# Altium schematic sheet QI9-2605-A01_.SchDoc
size D; SheetNumber: 1; SheetTotal: 1
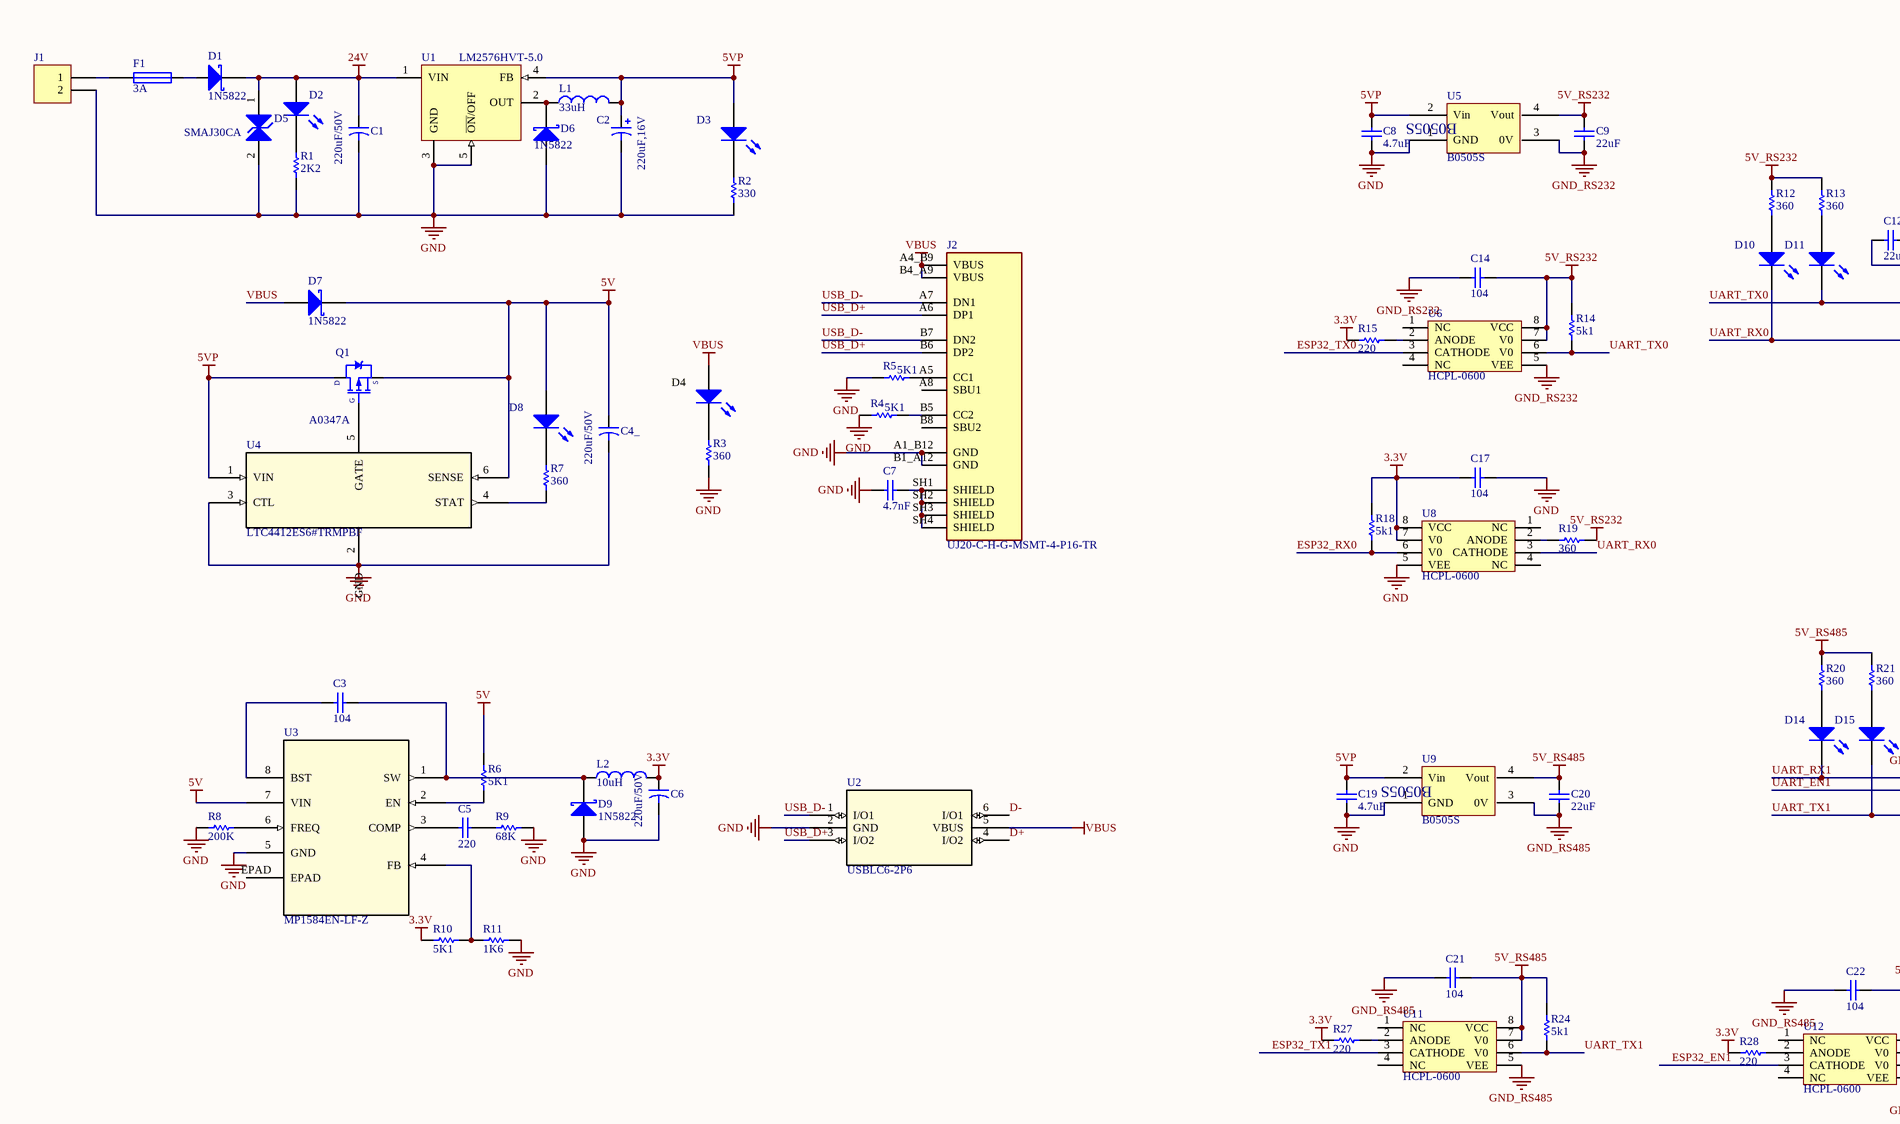
[diagram p0: QI9-2605-A01_.SchDoc, top left]
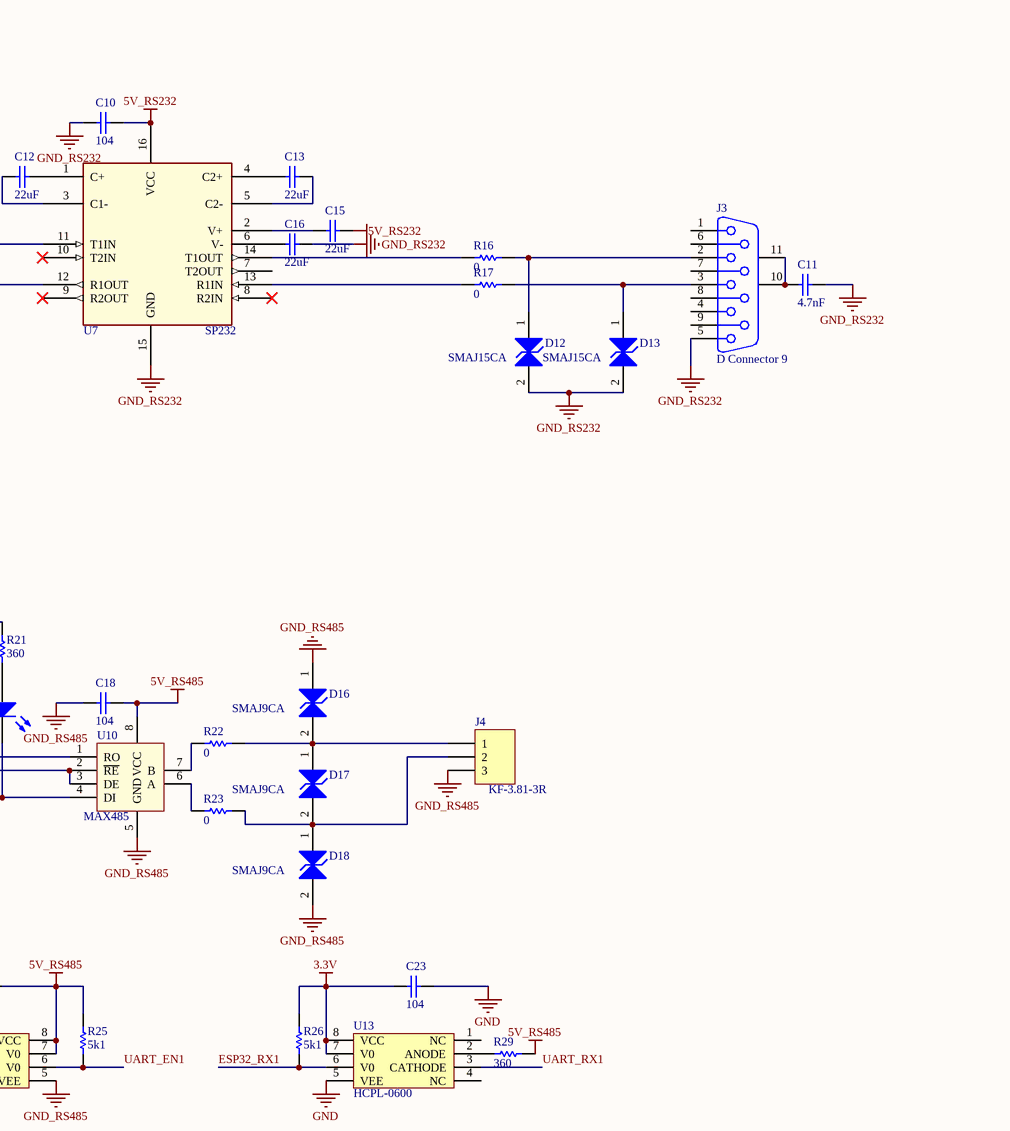
[diagram p1: QI9-2605-A01_.SchDoc, top right]
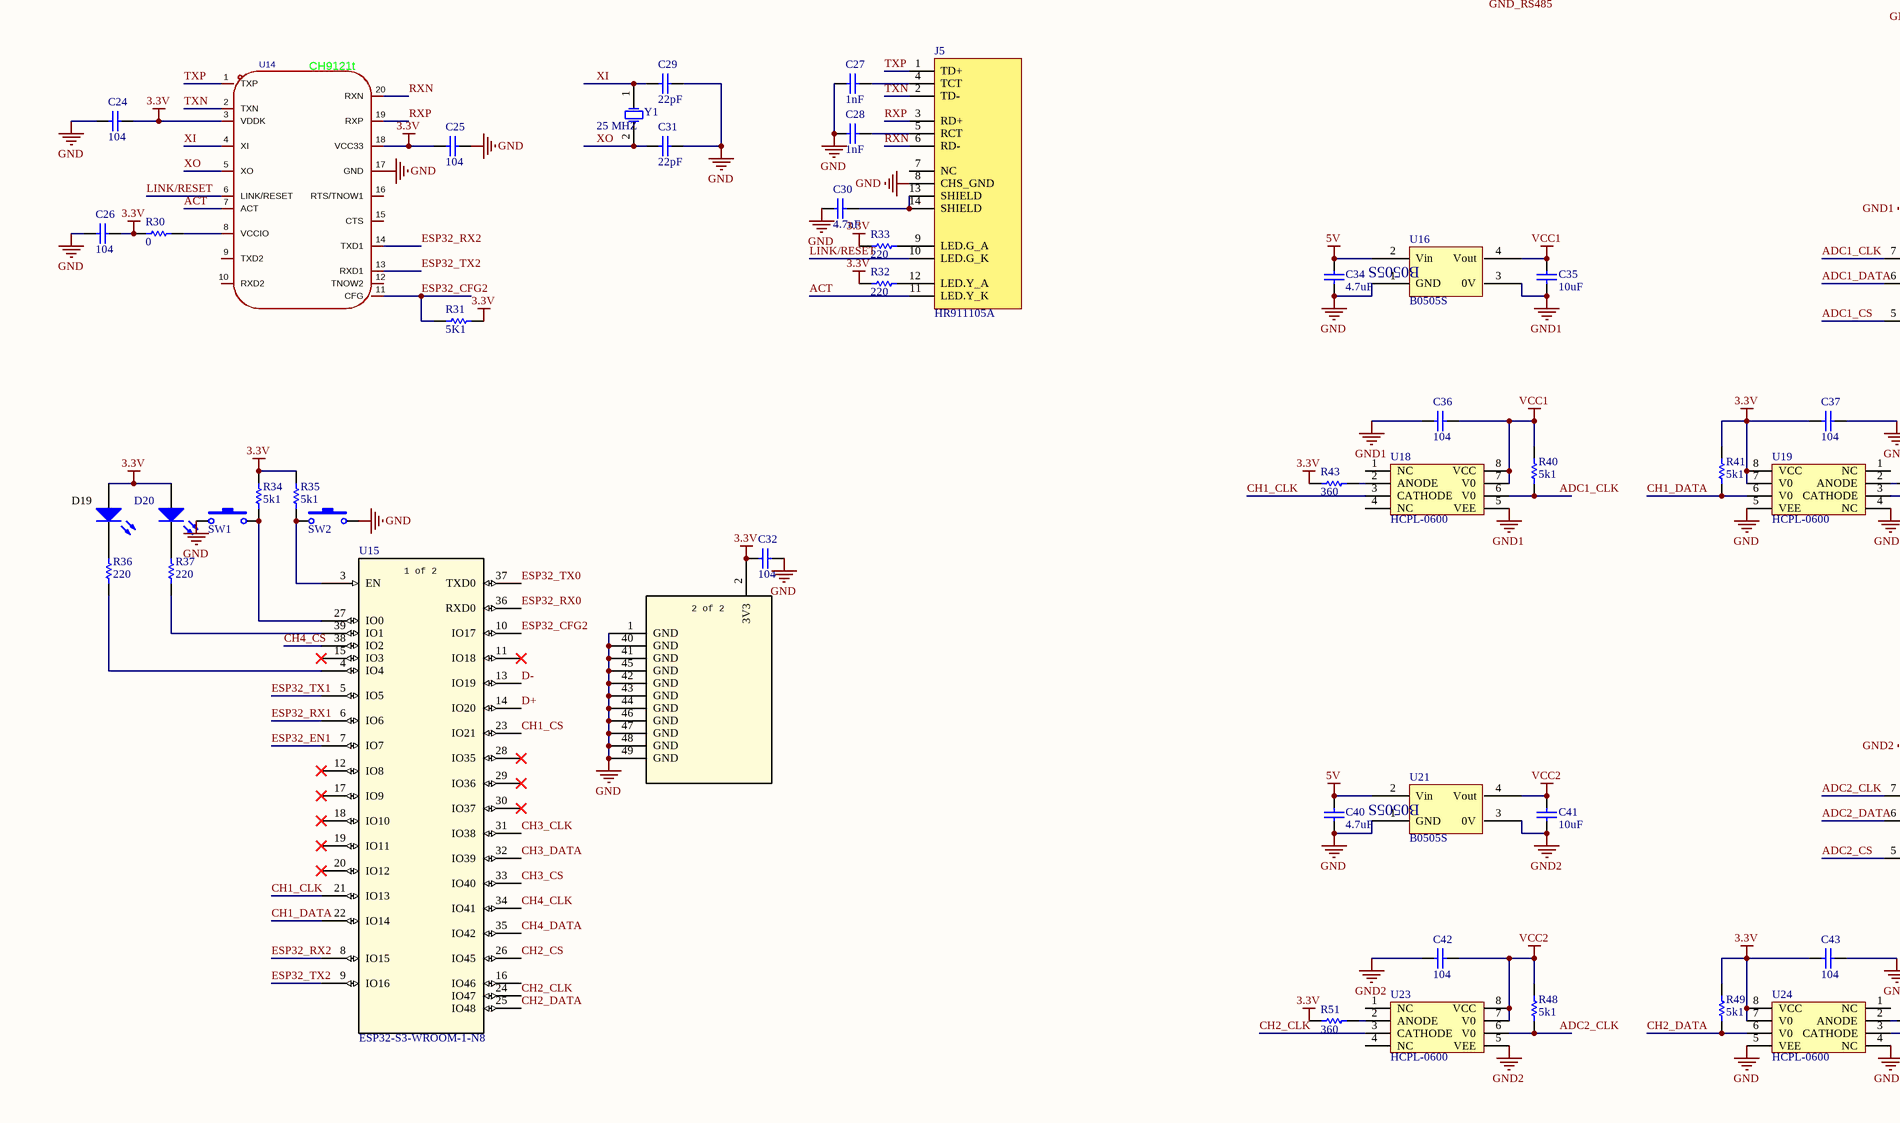
[diagram p2: QI9-2605-A01_.SchDoc, bottom left]
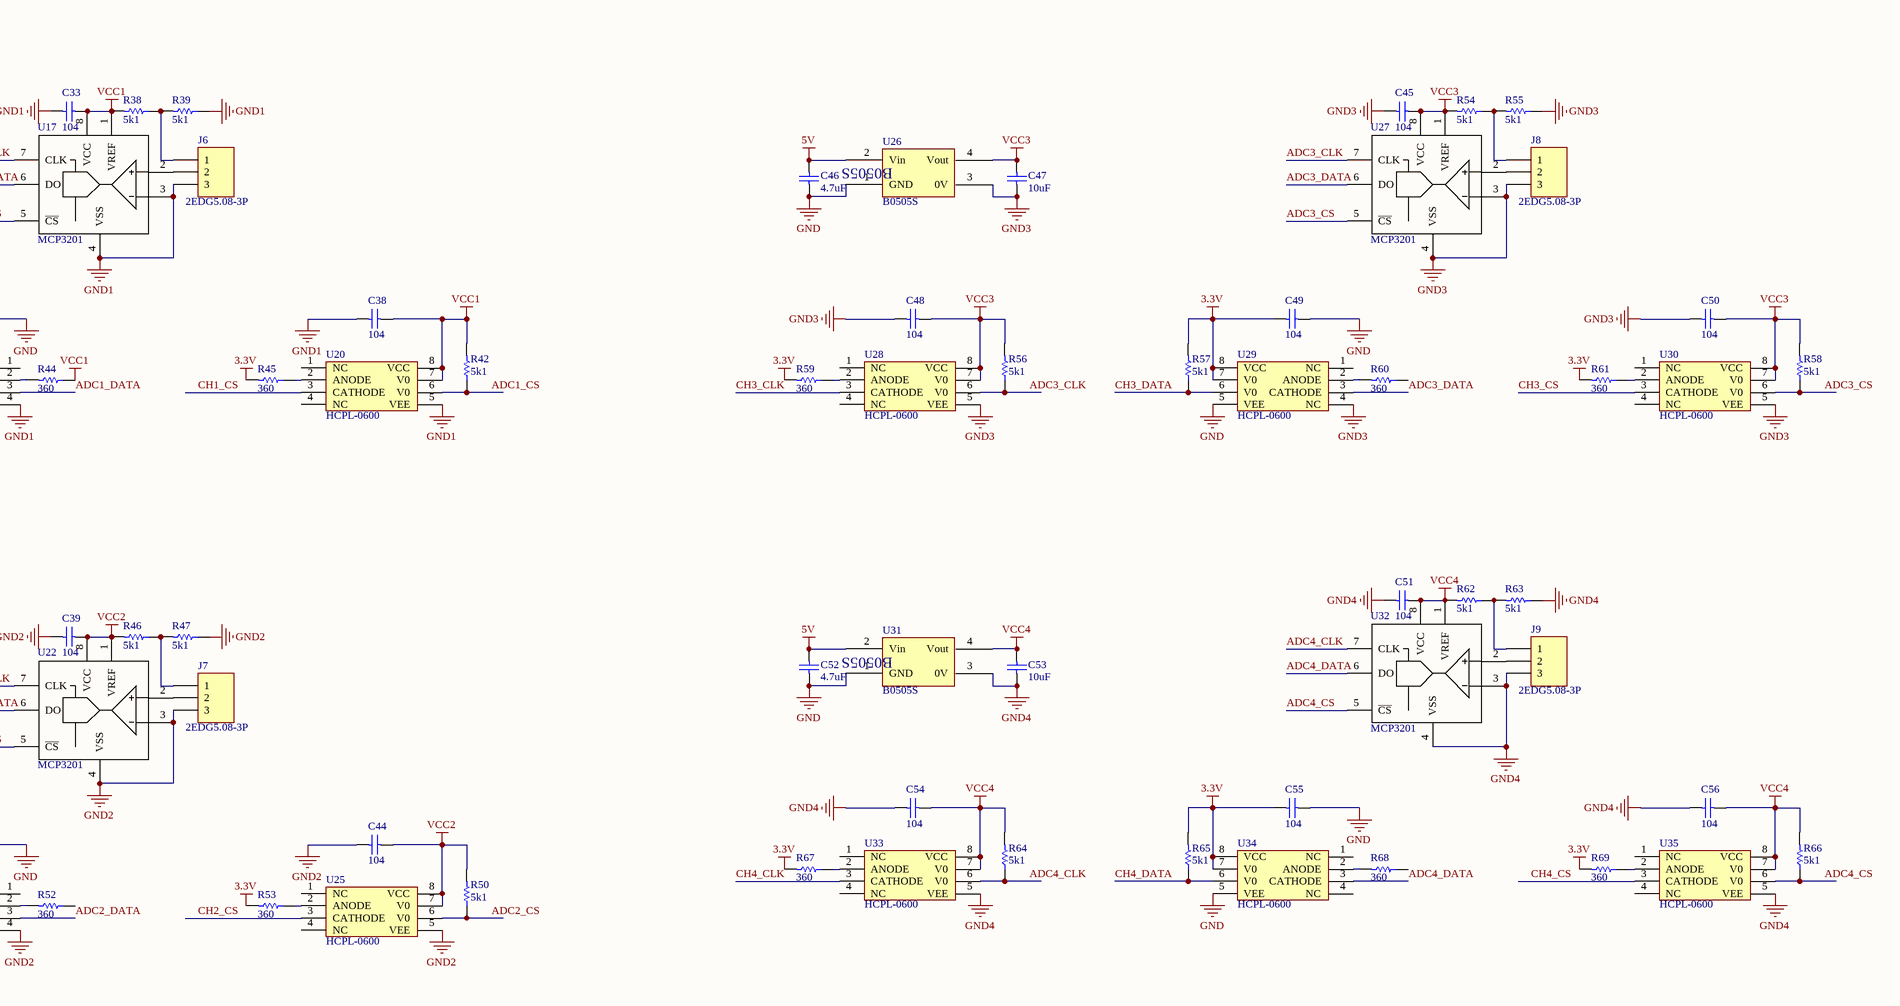
[diagram p3: QI9-2605-A01_.SchDoc, bottom right]

## Parts
C1  value 220uF/50V  [C2]  (hidden comment: Cap2)
C2  value 220uF,16V  [c2]
C3  value 104  [0805]  (hidden comment: Cap)
C4_  value 220uF/50V  [C2]  (hidden comment: Cap2)
C5  value 220  [0805]  (hidden comment: Cap)
C6  value 220uF/50V  [C2]  (hidden comment: Cap2)
C7  value 4.7nF  [0805]  (hidden comment: Cap)
C8  value 4.7uF  [CP1/2]  (hidden comment: Cap)
C9  value 22uF  [0805]  (hidden comment: Cap)
C10  value 104  [0805]  (hidden comment: Cap)
C11  value 4.7nF  [0805]  (hidden comment: Cap)
C12  value 22uF  [0805]  (hidden comment: Cap)
C13  value 22uF  [0805]  (hidden comment: Cap)
C14  value 104  [0805]  (hidden comment: Cap)
C15  value 22uF  [0805]  (hidden comment: Cap)
C16  value 22uF  [0805]  (hidden comment: Cap)
C17  value 104  [0805]  (hidden comment: Cap)
C18  value 104  [0805]  (hidden comment: Cap)
C19  value 4.7uF  [CP1/2]  (hidden comment: Cap)
C20  value 22uF  [0805]  (hidden comment: Cap)
C21  value 104  [0805]  (hidden comment: Cap)
C22  value 104  [0805]  (hidden comment: Cap)
C23  value 104  [0805]  (hidden comment: Cap)
C24  value 104  [0805]  (hidden comment: Cap)
C25  value 104  [0805]  (hidden comment: Cap)
C26  value 104  [0805]  (hidden comment: Cap)
C27  value 1nF  [0805]  (hidden comment: Cap)
C28  value 1nF  [0805]  (hidden comment: Cap)
C29  value 22pF  [0805]  (hidden comment: Cap)
C30  value 4.7nF  [0805]  (hidden comment: Cap)
C31  value 22pF  [0805]  (hidden comment: Cap)
C32  value 104  [0805]  (hidden comment: Cap)
C33  value 104  [0805]  (hidden comment: Cap)
C34  value 4.7uF  [CP1/2]  (hidden comment: Cap)
C35  value 10uF  [CP1/2]  (hidden comment: Cap)
C36  value 104  [0805]  (hidden comment: Cap)
C37  value 104  [0805]  (hidden comment: Cap)
C38  value 104  [0805]  (hidden comment: Cap)
C39  value 104  [0805]  (hidden comment: Cap)
C40  value 4.7uF  [CP1/2]  (hidden comment: Cap)
C41  value 10uF  [CP1/2]  (hidden comment: Cap)
C42  value 104  [0805]  (hidden comment: Cap)
C43  value 104  [0805]  (hidden comment: Cap)
C44  value 104  [0805]  (hidden comment: Cap)
C45  value 104  [0805]  (hidden comment: Cap)
C46  value 4.7uF  [CP1/2]  (hidden comment: Cap)
C47  value 10uF  [CP1/2]  (hidden comment: Cap)
C48  value 104  [0805]  (hidden comment: Cap)
C49  value 104  [0805]  (hidden comment: Cap)
C50  value 104  [0805]  (hidden comment: Cap)
C51  value 104  [0805]  (hidden comment: Cap)
C52  value 4.7uF  [CP1/2]  (hidden comment: Cap)
C53  value 10uF  [CP1/2]  (hidden comment: Cap)
C54  value 104  [0805]  (hidden comment: Cap)
C55  value 104  [0805]  (hidden comment: Cap)
C56  value 104  [0805]  (hidden comment: Cap)
D1  1N5822  [DIODE_DO214AC_SMA]
D2  LED  [LED_0805_RED]  (value not drawn)
D3  LED  [LED_0805_RED]  (value not drawn)
D4  LED  [LED_0805_RED]  (value not drawn)
D5  SMAJ30CA  [SMA_STM]
D6  1N5822  [DIODE_DO214AC_SMA]
D7  1N5822  [DIODE_DO214AC_SMA]
D8  LED  [LED_0805_RED]  (value not drawn)
D9  1N5822  [DIODE_DO214AC_SMA]
D10  LED  [LED_0805_RED]  (value not drawn)
D11  LED  [LED_0805_RED]  (value not drawn)
D12  SMAJ15CA  [SMA_STM]
D13  SMAJ15CA  [SMA_STM]
D14  LED  [LED_0805_RED]  (value not drawn)
D15  LED  [LED_0805_RED]  (value not drawn)
D16  SMAJ9CA  [SMA_STM]
D17  SMAJ9CA  [SMA_STM]
D18  SMAJ9CA  [SMA_STM]
D19  LED  [LED_0805_RED]  (value not drawn)
D20  LED  [LED_0805_RED]  (value not drawn)
F1  3A  [FUSE_1812(4532)]
J1  KF-3.810-2R  [KF2-3.81]  (value not drawn)
J2  UJ20-C-H-G-MSMT-4-P16-TR  [UJ20-C-H-G-MSMT-4-P16]
J3  D Connector 9  [DSUB1.385-2H9]
J4  KF-3.81-3R  [KF3-3.81]
J5  HR911105A  [HR911105A]
J6  2EDG5.08-3P  [CON 3 3EDG5.08]
J7  2EDG5.08-3P  [CON 3 3EDG5.08]
J8  2EDG5.08-3P  [CON 3 3EDG5.08]
J9  2EDG5.08-3P  [CON 3 3EDG5.08]
L1  value 33uH  [L1A]  (hidden comment: Inductor)
L2  value 10uH  [L1A]  (hidden comment: Inductor)
Q1  A0347A  [SOT23_]
R1  value 2K2  [SM-RES-0805]  (hidden comment: Res1)
R2  value 330  [SM-RES-0805]  (hidden comment: Res1)
R3  value 360  [SM-RES-0805]  (hidden comment: Res1)
R4  value 5K1  [SM-RES-0805]  (hidden comment: Res1)
R5  value 5K1  [SM-RES-0805]  (hidden comment: Res1)
R6  value 5K1  [SM-RES-0805]  (hidden comment: Res1)
R7  value 360  [SM-RES-0805]  (hidden comment: Res1)
R8  value 200K  [SM-RES-0805]  (hidden comment: Res1)
R9  value 68K  [SM-RES-0805]  (hidden comment: Res1)
R10  value 5K1  [SM-RES-0805]  (hidden comment: Res1)
R11  value 1K6  [SM-RES-0805]  (hidden comment: Res1)
R12  value 360  [SM-RES-0805]  (hidden comment: Res1)
R13  value 360  [SM-RES-0805]  (hidden comment: Res1)
R14  value 5k1  [SM-RES-0805]  (hidden comment: Res1)
R15  value 220  [SM-RES-0805]  (hidden comment: Res1)
R16  value 0  [SM-RES-0805]  (hidden comment: Res1)
R17  value 0  [SM-RES-0805]  (hidden comment: Res1)
R18  value 5k1  [SM-RES-0805]  (hidden comment: Res1)
R19  value 360  [SM-RES-0805]  (hidden comment: Res1)
R20  value 360  [SM-RES-0805]  (hidden comment: Res1)
R21  value 360  [SM-RES-0805]  (hidden comment: Res1)
R22  value 0  [SM-RES-0805]  (hidden comment: Res1)
R23  value 0  [SM-RES-0805]  (hidden comment: Res1)
R24  value 5k1  [SM-RES-0805]  (hidden comment: Res1)
R25  value 5k1  [SM-RES-0805]  (hidden comment: Res1)
R26  value 5k1  [SM-RES-0805]  (hidden comment: Res1)
R27  value 220  [SM-RES-0805]  (hidden comment: Res1)
R28  value 220  [SM-RES-0805]  (hidden comment: Res1)
R29  value 360  [SM-RES-0805]  (hidden comment: Res1)
R30  value 0  [SM-RES-0805]  (hidden comment: Res1)
R31  value 5K1  [SM-RES-0805]  (hidden comment: Res1)
R32  value 220  [SM-RES-0805]  (hidden comment: Res1)
R33  value 220  [SM-RES-0805]  (hidden comment: Res1)
R34  value 5k1  [SM-RES-0805]  (hidden comment: Res1)
R35  value 5k1  [SM-RES-0805]  (hidden comment: Res1)
R36  value 220  [SM-RES-0805]  (hidden comment: Res1)
R37  value 220  [SM-RES-0805]  (hidden comment: Res1)
R38  value 5k1  [SM-RES-0805]  (hidden comment: Res1)
R39  value 5k1  [SM-RES-0805]  (hidden comment: Res1)
R40  value 5k1  [SM-RES-0805]  (hidden comment: Res1)
R41  value 5k1  [SM-RES-0805]  (hidden comment: Res1)
R42  value 5k1  [SM-RES-0805]  (hidden comment: Res1)
R43  value 360  [SM-RES-0805]  (hidden comment: Res1)
R44  value 360  [SM-RES-0805]  (hidden comment: Res1)
R45  value 360  [SM-RES-0805]  (hidden comment: Res1)
R46  value 5k1  [SM-RES-0805]  (hidden comment: Res1)
R47  value 5k1  [SM-RES-0805]  (hidden comment: Res1)
R48  value 5k1  [SM-RES-0805]  (hidden comment: Res1)
R49  value 5k1  [SM-RES-0805]  (hidden comment: Res1)
R50  value 5k1  [SM-RES-0805]  (hidden comment: Res1)
R51  value 360  [SM-RES-0805]  (hidden comment: Res1)
R52  value 360  [SM-RES-0805]  (hidden comment: Res1)
R53  value 360  [SM-RES-0805]  (hidden comment: Res1)
R54  value 5k1  [SM-RES-0805]  (hidden comment: Res1)
R55  value 5k1  [SM-RES-0805]  (hidden comment: Res1)
R56  value 5k1  [SM-RES-0805]  (hidden comment: Res1)
R57  value 5k1  [SM-RES-0805]  (hidden comment: Res1)
R58  value 5k1  [SM-RES-0805]  (hidden comment: Res1)
R59  value 360  [SM-RES-0805]  (hidden comment: Res1)
R60  value 360  [SM-RES-0805]  (hidden comment: Res1)
R61  value 360  [SM-RES-0805]  (hidden comment: Res1)
R62  value 5k1  [SM-RES-0805]  (hidden comment: Res1)
R63  value 5k1  [SM-RES-0805]  (hidden comment: Res1)
R64  value 5k1  [SM-RES-0805]  (hidden comment: Res1)
R65  value 5k1  [SM-RES-0805]  (hidden comment: Res1)
R66  value 5k1  [SM-RES-0805]  (hidden comment: Res1)
R67  value 360  [SM-RES-0805]  (hidden comment: Res1)
R68  value 360  [SM-RES-0805]  (hidden comment: Res1)
R69  value 360  [SM-RES-0805]  (hidden comment: Res1)
SW1  SW-SMD  [SW-SMD]  (value not drawn)
SW2  SW-SMD  [SW-SMD]  (value not drawn)
U1  LM2576HVT-5.0  [T05]
U2  USBLC6-2P6  [SOT-666_STM]
U3  MP1584EN-LF-Z  [SOIC8E_MPS]
U4  LTC4412ES6#TRMPBF  [SOT-6_S_LIT]
U5  B0505S  [B0505S]
U6  HCPL-0600  [SOIC8_50_328_25X90_SMT]
U7  SP232  [soic16_m]
U8  HCPL-0600  [SOIC8_50_328_25X90_SMT]
U9  B0505S  [B0505S]
U10  MAX485  [DIP8]
U11  HCPL-0600  [SOIC8_50_328_25X90_SMT]
U12  HCPL-0600  [SOIC8_50_328_25X90_SMT]
U13  HCPL-0600  [SOIC8_50_328_25X90_SMT]
U14  CH9121t  [tssop20]
U15  ESP32-S3-WROOM-1-N8  [ESP32-S3-WROOM-1_EXP]
U16  B0505S  [B0505S]
U17  MCP3201  [SO8]
U18  HCPL-0600  [SOIC8_50_328_25X90_SMT]
U19  HCPL-0600  [SOIC8_50_328_25X90_SMT]
U20  HCPL-0600  [SOIC8_50_328_25X90_SMT]
U21  B0505S  [B0505S]
U22  MCP3201  [SO8]
U23  HCPL-0600  [SOIC8_50_328_25X90_SMT]
U24  HCPL-0600  [SOIC8_50_328_25X90_SMT]
U25  HCPL-0600  [SOIC8_50_328_25X90_SMT]
U26  B0505S  [B0505S]
U27  MCP3201  [SO8]
U28  HCPL-0600  [SOIC8_50_328_25X90_SMT]
U29  HCPL-0600  [SOIC8_50_328_25X90_SMT]
U30  HCPL-0600  [SOIC8_50_328_25X90_SMT]
U31  B0505S  [B0505S]
U32  MCP3201  [SO8]
U33  HCPL-0600  [SOIC8_50_328_25X90_SMT]
U34  HCPL-0600  [SOIC8_50_328_25X90_SMT]
U35  HCPL-0600  [SOIC8_50_328_25X90_SMT]
Y1  25 MHZ  [Crystal.smd_N]

## Nets
3.3V: C6.1 C17.1 C23.1 C24.2 C25.1 C26.2 C32.1 C37.1 C43.1 C49.1 C55.1 D19.1(A) D20.1(A) L2.2 R10.2 R15.2 R18.2 R26.2 R27.2 R28.2 R30.2 R31.1 R32.2 R33.2 R34.2 R35.2 R41.2 R43.2 R45.2 R49.2 R51.2 R53.2 R57.2 R59.2 R61.2 R65.2 R67.2 R69.2 U8.7(V0) U8.8(VCC) U13.7(V0) U13.8(VCC) U14.3(VDDK) U14.18(VCC33) U15.2(3V3) U19.7(V0) U19.8(VCC) U24.7(V0) U24.8(VCC) U29.7(V0) U29.8(VCC) U34.7(V0) U34.8(VCC)
5V: C4_.1 C34.1 C40.1 C46.1 C52.1 D7.2(K) D8.1(A) Q1.3(S) R6.2 U3.7(VIN) U4.6(SENSE) U16.2(Vin) U21.2(Vin) U26.2(Vin) U31.2(Vin)
5V_RS232: C9.2 C10.2 C14.2 C15.2 R12.2 R13.2 R14.2 R19.1 U5.4(Vout) U6.7(V0) U6.8(VCC) U7.16(VCC)
5V_RS485: C18.2 C20.2 C21.2 C22.2 R20.2 R21.2 R24.2 R25.2 R29.1 U9.4(Vout) U10.8(VCC) U11.7(V0) U11.8(VCC) U12.7(V0) U12.8(VCC)
5VP: C2.1 C8.1 C19.1 D3.1(A) L1.2 Q1.2(D) U1.4(FB) U4.1(VIN) U5.2(Vin) U9.2(Vin)
24V: C1.1 D1.2(K) D2.1(A) D5.1(A) U1.1(VIN)
GND: C1.2 C2.2 C4_.2 C6.2 C7.1 C8.2 C17.2 C19.2 C23.2 C24.1 C25.2 C26.1 C27.1 C28.1 C29.2 C30.1 C31.2 C32.2 C34.2 C37.2 C40.2 C43.2 C46.2 C49.2 C52.2 C55.2 D5.2(K) D6.1(A) D9.1(A) J1.2 J2.A1_B12(GND) J2.B1_A12(GND) J5.8(CHS_GND) R1.1 R2.1 R3.1 R4.2 R5.2 R8.2 R9.1 R11.1 SW1.1 SW2.2 U1.3(GND) U1.5(~{ON}/OFF) U2.2(GND) U3.5(GND) U4.3(CTL) U5.1(GND) U8.5(VEE) U9.1(GND) U13.5(VEE) U14.17(GND) U15.1(GND) U15.40(GND) U15.41(GND) U15.42(GND) U15.43(GND) U15.44(GND) U15.45(GND) U15.46(GND) U15.47(GND) U15.48(GND) U15.49(GND) U16.1(GND) U19.5(VEE) U21.1(GND) U24.5(VEE) U26.1(GND) U29.5(VEE) U31.1(GND) U34.5(VEE)
GND1: C33.1 C35.2 C36.1 C38.1 J6.3 R39.1 U16.3(0V) U17.3 U17.4(VSS) U18.5(VEE) U19.4(NC) U20.5(VEE)
GND2: C39.1 C41.2 C42.1 C44.1 J7.3 R47.1 U21.3(0V) U22.3 U22.4(VSS) U23.5(VEE) U24.4(NC) U25.5(VEE)
GND3: C45.1 C47.2 C48.1 C50.1 J8.3 R55.1 U26.3(0V) U27.3 U27.4(VSS) U28.5(VEE) U29.4(NC) U30.5(VEE)
GND4: C51.1 C53.2 C54.1 C56.1 J9.3 R63.1 U31.3(0V) U32.3 U32.4(VSS) U33.5(VEE) U35.5(VEE)
GND_RS232: C9.1 C10.1 C11.2 C14.1 C16.1 D12.2(K) D13.2(K) J3.5 U5.3(0V) U6.5(VEE) U7.15(GND)
GND_RS485: C18.1 C20.1 C21.1 C22.1 D16.1(A) D18.2(K) J4.3 U9.3(0V) U10.5(GND) U11.5(VEE) U12.5(VEE)
VBUS: D4.1(A) D7.1(A) J2.A4_B9(VBUS) J2.B4_A9(VBUS) U2.5(VBUS)
VCC1: C33.2 C35.1 C36.2 C38.2 R38.2 R40.2 R42.2 R44.1 U16.4(Vout) U17.1(VREF) U17.8(VCC) U18.7(V0) U18.8(VCC) U20.7(V0) U20.8(VCC)
VCC2: C39.2 C41.1 C42.2 C44.2 R46.2 R48.2 R50.2 U21.4(Vout) U22.1(VREF) U22.8(VCC) U23.7(V0) U23.8(VCC) U25.7(V0) U25.8(VCC)
VCC3: C45.2 C47.1 C48.2 C50.2 R54.2 R56.2 R58.2 U26.4(Vout) U27.1(VREF) U27.8(VCC) U28.7(V0) U28.8(VCC) U30.7(V0) U30.8(VCC)
VCC4: C51.2 C53.1 C54.2 C56.2 R62.2 R64.2 R66.2 U31.4(Vout) U32.1(VREF) U32.8(VCC) U33.7(V0) U33.8(VCC) U35.7(V0) U35.8(VCC)
ACT: J5.11(LED.Y_K) U14.7(ACT)
ADC1_CLK: R40.1 U17.7(CLK) U18.6(V0)
ADC1_CS: R42.1 U17.5(~{CS}) U20.6(V0)
ADC1_DATA: U17.6(DO) U19.3(CATHODE)
ADC2_CLK: R48.1 U22.7(CLK) U23.6(V0)
ADC2_CS: R50.1 U22.5(~{CS}) U25.6(V0)
ADC2_DATA: U22.6(DO) U24.3(CATHODE)
ADC3_CLK: R56.1 U27.7(CLK) U28.6(V0)
ADC3_CS: R58.1 U27.5(~{CS}) U30.6(V0)
ADC3_DATA: U27.6(DO) U29.3(CATHODE)
ADC4_CLK: R64.1 U32.7(CLK) U33.6(V0)
ADC4_CS: R66.1 U32.5(~{CS}) U35.6(V0)
ADC4_DATA: U32.6(DO) U34.3(CATHODE)
CH1_CLK: U15.21(IO13) U18.3(CATHODE)
CH1_CS: U15.23(IO21) U20.3(CATHODE)
CH1_DATA: R41.1 U15.22(IO14) U19.6(V0)
CH2_CLK: U15.24(IO47) U23.3(CATHODE)
CH2_CS: U15.26(IO45) U25.3(CATHODE)
CH2_DATA: R49.1 U15.25(IO48) U24.6(V0)
CH3_CLK: U15.31(IO38) U28.3(CATHODE)
CH3_CS: U15.33(IO40) U30.3(CATHODE)
CH3_DATA: R57.1 U15.32(IO39) U29.6(V0)
CH4_CLK: U15.34(IO41) U33.3(CATHODE)
CH4_CS: U15.38(IO2) U35.3(CATHODE)
CH4_DATA: R65.1 U15.35(IO42) U34.6(V0)
D+: U2.4(I/O2) U15.14(IO20)
D-: U2.6(I/O1) U15.13(IO19)
ESP32_CFG2: R31.2 U14.11(CFG) U15.10(IO17)
ESP32_EN1: U12.3(CATHODE) U15.7(IO7)
ESP32_RX0: R18.1 U8.6(V0) U15.36(RXD0)
ESP32_RX1: R26.1 U13.6(V0) U15.6(IO6)
ESP32_RX2: U14.14(TXD1) U15.8(IO15)
ESP32_TX0: U6.3(CATHODE) U15.37(TXD0)
ESP32_TX1: U11.3(CATHODE) U15.5(IO5)
ESP32_TX2: U14.13(RXD1) U15.9(IO16)
LINK/RESET: J5.10(LED.G_K) U14.6(LINK/RESET)
RXN: J5.6(RD-) U14.20(RXN)
RXP: J5.3(RD+) U14.19(RXP)
TXN: J5.2(TD-) U14.2(TXN)
TXP: J5.1(TD+) U14.1(TXP)
UART_EN1: R25.1 U10.2(~{RE}) U10.3(DE) U12.6(V0)
UART_RX0: D10.2(K) U7.12(R1OUT) U8.3(CATHODE)
UART_RX1: D14.2(K) U10.1(RO) U13.3(CATHODE)
UART_TX0: D11.2(K) R14.1 U6.6(V0) U7.11(T1IN)
UART_TX1: D15.2(K) R24.1 U10.4(DI) U11.6(V0)
USB_D+: J2.A6(DP1) J2.B6(DP2) U2.3(I/O2)
USB_D-: J2.A7(DN1) J2.B7(DN2) U2.1(I/O1)
XI: C29.1 U14.4(XI) Y1.1(OSC1)
XO: C31.1 U14.5(XO) Y1.2(OSC2)
NetC3_1: C3.1 U3.8(BST)
NetC3_2: C3.2 D9.2(K) L2.1 U3.1(SW)
NetC5_1: C5.1 U3.3(COMP)
NetC5_2: C5.2 R9.2
NetC7_2: C7.2 J2.SH1(SHIELD) J2.SH2(SHIELD) J2.SH3(SHIELD) J2.SH4(SHIELD)
NetC11_1: C11.1 J3.10(MH1) J3.11(MH2)
NetC12_1: C12.1 U7.3(C1-)
NetC12_2: C12.2 U7.1(C+)
NetC13_1: C13.1 U7.4(C2+)
NetC13_2: C13.2 U7.5(C2-)
NetC15_1: C15.1 U7.2(V+)
NetC16_2: C16.2 U7.6(V-)
NetC27_2: C27.2 J5.4(TCT)
NetC28_2: C28.2 J5.5(RCT)
NetC30_2: C30.2 J5.13(SHIELD) J5.14(SHIELD)
NetD1_1: D1.1(A) F1.2
NetD2_2: D2.2(K) R1.2
NetD3_2: D3.2(K) R2.2
NetD4_2: D4.2(K) R3.2
NetD6_2: D6.2(K) L1.1 U1.2(OUT)
NetD8_2: D8.2(K) R7.2
NetD10_1: D10.1(A) R12.1
NetD11_1: D11.1(A) R13.1
NetD12_1: D12.1(A) J3.2 R16.1
NetD13_1: D13.1(A) J3.3 R17.1
NetD14_1: D14.1(A) R20.1
NetD15_1: D15.1(A) R21.1
NetD16_2: D16.2(K) D17.1(A) J4.1 R22.1
NetD17_2: D17.2(K) D18.1(A) J4.2 R23.1
NetD19_2: D19.2(K) R36.1
NetD20_2: D20.2(K) R37.1
NetF1_1: F1.1 J1.1
NetJ2_A5: J2.A5(CC1) R5.1
NetJ2_B5: J2.B5(CC2) R4.1
NetJ5_9: J5.9(LED.G_A) R33.1
NetJ5_12: J5.12(LED.Y_A) R32.1
NetJ6_1: J6.1 R38.1 R39.2
NetJ6_2: J6.2 U17.2
NetJ7_1: J7.1 R46.1 R47.2
NetJ7_2: J7.2 U22.2
NetJ8_1: J8.1 R54.1 R55.2
NetJ8_2: J8.2 U27.2
NetJ9_1: J9.1 R62.1 R63.2
NetJ9_2: J9.2 U32.2
NetQ1_1: Q1.1(G) U4.5(GATE)
NetR6_1: R6.1 U3.2(EN)
NetR7_1: R7.1 U4.4(STAT)
NetR8_1: R8.1 U3.6(FREQ)
NetR10_1: R10.1 R11.2 U3.4(FB)
NetR15_1: R15.1 U6.2(ANODE)
NetR16_2: R16.2 U7.14(T1OUT)
NetR17_2: R17.2 U7.13(R1IN)
NetR19_2: R19.2 U8.2(ANODE)
NetR22_2: R22.2 U10.7(B)
NetR23_2: R23.2 U10.6(A)
NetR27_1: R27.1 U11.2(ANODE)
NetR28_1: R28.1 U12.2(ANODE)
NetR29_2: R29.2 U13.2(ANODE)
NetR30_1: R30.1 U14.8(VCCIO)
NetR34_1: R34.1 SW1.2 U15.27(IO0)
NetR35_1: R35.1 SW2.1 U15.3(EN)
NetR36_2: R36.2 U15.4(IO4)
NetR37_2: R37.2 U15.39(IO1)
NetR43_1: R43.1 U18.2(ANODE)
NetR44_2: R44.2 U19.2(ANODE)
NetR45_1: R45.1 U20.2(ANODE)
NetR51_1: R51.1 U23.2(ANODE)
NetR52_2: R52.2 U24.2(ANODE)
NetR53_1: R53.1 U25.2(ANODE)
NetR59_1: R59.1 U28.2(ANODE)
NetR60_2: R60.2 U29.2(ANODE)
NetR61_1: R61.1 U30.2(ANODE)
NetR67_1: R67.1 U33.2(ANODE)
NetR68_2: R68.2 U34.2(ANODE)
NetR69_1: R69.1 U35.2(ANODE)

Not connected (* = marked no-connect by the designer): J2 A8(SBU1) B8(SBU2); J3 1 4 6 7 8 9; J5 7(NC); R52 1; R60 1; R68 1; U3 EPAD; U4 2(GND); U6 1(NC) 4(NC); U7 7(T2OUT) 8(R2IN)* 9(R2OUT)* 10(T2IN)*; U8 1(NC) 4(NC); U11 1(NC) 4(NC); U12 1(NC) 4(NC); U13 1(NC) 4(NC); U14 9(TXD2) 10(RXD2) 12(TNOW2) 15(CTS) 16(RTS/TNOW1); U15 11(IO18)* 12(IO8)* 15(IO3)* 16(IO46) 17(IO9)* 18(IO10)* 19(IO11)* 20(IO12)* 28(IO35)* 29(IO36)* 30(IO37)*; U18 1(NC) 4(NC); U19 1(NC); U20 1(NC) 4(NC); U23 1(NC) 4(NC); U24 1(NC); U25 1(NC) 4(NC); U28 1(NC) 4(NC); U29 1(NC); U30 1(NC) 4(NC); U33 1(NC) 4(NC); U34 1(NC) 4(NC); U35 1(NC) 4(NC)

## Notes on the sheet
- (in symbol ESP32-S3-WROOM-1) 1 of 2; 2 of 2

## Library data of the parts
C1 C4_ C6 = Cap2: Capacitor; Published: 23-Sep-2002; PackageReference: CAPR5-4X5; Publisher: Altium Limited
C2 = Cap Pol 3mm: Polarized Capacitor (Axial); Published: 8-Jun-2000; LatestRevisionDate: 17-Jul-2002; LatestRevisionNote: Re-released for DXP Platform.; PackageReference: POLAR0.8; Publisher: Altium Limited
C3 C5 C7-C56 = Cap: Capacitor; Published: 8-Jun-2000; LatestRevisionDate: 17-Jul-2002; LatestRevisionNote: Re-released for DXP Platform.; PackageReference: RAD-0.3; Publisher: Altium Limited
D1 D6 D7 D9 = D Schottky: Schottky Diode; Published: 8-Jun-2000; LatestRevisionDate: 17-Jul-2002; LatestRevisionNote: Re-released for DXP Platform.; PackageReference: SMB; Publisher: Altium Limited; Code_JEDEC: DO-214-AA
D2-D4 D8 D10 D11 D14 D15 D19 D20 = LED0: Typical INFRARED GaAs LED; Published: 8-Jun-2000; LatestRevisionDate: 08-Jul-2005; LatestRevisionNote: Mech Layer 1 removed.; PackageReference: LED-0; Publisher: Altium Limited
D5 D12 D13 D16-D18 = SMAJ30CA: TVS DIODE 30V 48.4V DO214AC; MFR: Littelfuse Inc.; Value: SMAJ30A; Solder: SMT; MPN: SMAJ30A
F1 = Fuse 1: Fuse; Published: 8-Jun-2000; LatestRevisionDate: 17-Jul-2002; LatestRevisionNote: Re-released for DXP Platform.; PackageReference: PIN-W2/E2.8; Publisher: Altium Limited
J1 = Header 2: Header, 2-Pin; LatestRevisionDate: 17-Jul-2002; LatestRevisionNote: Re-released for DXP Platform.; Publisher: Altium Limited
J2 = UJ20-C-H-G-MSMT-4-P16-TR: MF: {'manufacturer': u'Same Sky (Formerly CUI Devices)'}; Package: None; Price: None; Value: *; MP: UJ20-C-H-G-MSMT-4-P16-TR; Availability: Unavailable
J3 = DB9_RA: Receptacle Assembly, 9 Position, Right Angle; PackageDocument: O; Positions: 9; Published: 15-Jun-2001; LatestRevisionDate: 17-Jul-2002; LatestRevisionNote: Re-released for DXP Platform.; DatasheetDocument: 1-Sep-1999; PackageReference: 788750; Publisher: Altium Limited; Orientation: Right Angle; Gender: Receptacle
J4 J6-J9 = Header 3: Header, 3-Pin; LatestRevisionDate: 17-Jul-2002; LatestRevisionNote: Re-released for DXP Platform.; Publisher: Altium Limited
J5 = HR911105A: Hanrun HR911105A RJ-45 Connector; Solder: WAVE; MPN: HR911105A; MFR: HanRun; Value: HR911105A
L1 L2 = Inductor: Code_IEC: 1005; Published: 8-Jun-2000; LatestRevisionDate: 29-May-2009; LatestRevisionNote: IPC-7351 Footprint Added.; PackageReference: 0402-A; Publisher: Altium Limited; PackageDescription: Chip Inductor; Code_JEITA: 0402
Q1 = IRF9540: HEXFET P-Channel Power MOSFET; Note: Pin 2 is electrically connected to pin 4.; Published: 8-Jun-2000; LatestRevisionDate: 17-Jul-2002; LatestRevisionNote: Re-released for DXP Platform.; DatasheetVersion: PD-9.421C; PackageVersion: Feb-1997; PackageReference: TO-220AB; Publisher: Altium Limited; PackageDescription: TO, Thru-Hole, Vertical, Heatsink Mounted; 3 In-Line Leads; Pitch 2.54 mm; ComponentLink1Description: Manufacturer Link; ComponentLink1URL: http://www.irf.com/; ComponentLink2Description: Datasheet; ComponentLink2URL: http://www.irf.com/product-info/datasheets/data/irf9540.pdf
R1-R69 = Res1: Resistor; Published: 8-Jun-2000; LatestRevisionDate: 17-Jul-2002; LatestRevisionNote: Re-released for DXP Platform.; PackageReference: AXIAL-0.3; Publisher: Altium Limited
SW1 SW2 = SW-SMD: Switch; Published: 24-Mar-1999; LatestRevisionDate: 17-Jul-2002; LatestRevisionNote: Re-released for DXP Platform.; PackageReference: SPST-2; Publisher: Altium Limited
U1 = LM2576HVT-5.0: SIMPLE SWITCHER; 3A Step-Down Voltage Regulator; Manufacturer: National Semiconductor; PackageTopMarking: NSUZXYTT*LM2576HVT*-5.0 P+; PowerWise: N; FirstPublished: 4-Dec-2008; DatasheetVersion: Aug-2004; PackageVersion: revJ, Jan-1992; PackageReference: T05A; Publisher: Altium Limited; PackageDescription: TO-220, Molded, 5 Lead, Straight; CompType: Switcher; PartNumber: LM2576HVT-5.0; RoHS: O; PinCount: 5; DigiKeyPartNumber: LM2576HVT-5.0-ND; Code_JEDEC: TO-220-AB; ComponentLink1Description: LM2576HV Datasheet; ComponentLink1URL: http://www.national.com/ds/LM/LM2576HV.pdf; ComponentLink2Description: LM2576HV Web Page; ComponentLink2URL: http://www.national.com/pf/LM/LM2576HV.html; ComponentLink3Description: T05A Package Page; ComponentLink3URL: http://www.national.com/packaging/folders/t05a.html
U2 = USBLC6-2P6: ESD Protection for USB 2.0 High Speed; Manufacturer_Name: STMicroelectronics; Copyright: Copyright (C) 2025 Ultra Librarian. All rights reserved.; Manufacturer_Part_Number: USBLC6-2P6; RefDes: RefDes; Type: Type
U3 = MP1584EN-LF-Z: <p>3A 1.5MHz 28V Step-Down Converter</p>; Manufacturer_Name: Monolithic Power Systems; Copyright: Copyright (C) 2026 Ultra Librarian. All rights reserved.; Manufacturer_Part_Number: MP1584EN-LF-Z; RefDes: RefDes; Type: Type
U4 = LTC4412ES6TRMPBF: Low Loss PowerPathâ„¢ Controller in ThinSOT; Manufacturer_Name: Analog Devices Inc; Copyright: Copyright (C) 2025 Ultra Librarian. All rights reserved.; Manufacturer_Part_Number: LTC4412ES6#TRMPBF; RefDes: RefDes; Type: Type
U5 U9 U16 U21 U26 U31 = B0505S: Cắm; Ten_Linh_Kien: B0505S-1W SIP4 IC Converter DC-DC; Don_Vi: Con; Ma_Hang: MH003143; Ghi_Chu: *; Kieu_Chan: *; Chung_Loai: Cắm
U6 U8 U11-U13 U18-U20 U23-U25 U28-U30 U33-U35 = IC_HCPL-3120-500E: 2.5A Gate Driver Optical Coupling 3750Vrms 1 Channel 8-DIP Gull Wing; Manufacturer: Broadcom Avago; Alternate Part Number-1: NA; Manufacturer Part Number: HCPL-3120-500E; Case/Package: SOIC8; Supplier-1: MOUSER; Supplier Part Number-1: HCPL-3120-500E
U7 = SP232: Enhanced RS-232 Line Drivers/Receivers; Manufacturer: Sipex; Vendor: Digikey; Volt: 5V; Data Rate (Max): 120kbps; Published: 13-April-2009; Publisher: Hoang Nguyen; ComponentLink1Description: Digikey Part Link; ComponentLink2Description: Open Datasheet; ComponentLink2URL: H:\LIBRARY\LIBRARY.Datasheet\
U10 = MAX485: RS232 - RS485 (Same sn75176)
U14 = ch9121t_c45354919: Type:Ethernet Transceiver Number of ports: Ethernet Speed Standards:10BASE-T；100BASE-TX Data Rate:100Mbit/s；10Mbit/s Voltage - Supply:3.2V~3.4V Voltage - Supply:3.2V~3.4V Operating Temperature:-40℃~+85℃ Operating Temperature:-40℃~+85℃ Features:Programmabl; Manufacturer: WCH(南京沁恒); AddInBom: yes; ModelId: d00c537554e8428abe371c2c4fe2166f; ModelName: TSSOP-20_L6.5-W4.4-H1.0-LS6.4-P0.65; ModelTransform: 251.969,255.906,0,90,0,0,0.0005,0,0; Symbol: CH9121T_C45354919; LCSC Part Name: 网络串口透传芯片; SupplierPart: C45354919; ManufacturerPart: CH9121T; Supplier Footprint: TSSOP-20; JLCPCB Part Class: Extended Part; Datasheet: https://item.szlcsc.com/datasheet/CH9121T/47444202.html; Supplier: LCSC; ConvertToPcb: yes; FootprintName: TSSOP-20_L6.5-W4.4-P0.65-LS6.4-BL; Type: Ethernet Transceiver; Ethernet Speed Standards: 10BASE-T；100BASE-TX; Data Rate: 100Mbit/s；10Mbit/s; Voltage - Supply: 3.2V~3.4V; Operating Temperature: -40℃~+85℃; Features: Programmable LED indication；Power-on reset
U15 = ESP32-S3-WROOM-1: Description; Manufacturer_Name: Espressif Systems; Type: Transceiver module; Copyright: Copyright (C) 2026 Ultra Librarian. All rights reserved.; Manufacturer_Part_Number: ESP32-S3-WROOM-1-N8; RefDes: RefDes
U17 U22 U27 U32 = MCP3201: 12 BIT A/D CONVERTOR; Manufacturer Part Number: MCP3201-CI/SN; Manufacturer: Microchip Technology; Data Interface: Serial, SPI™; Number of Inputs and Type: 1 Single-Ended, Unipolar; Sampling Rate (Per Second): 100k; Number of Converters: 1; Number of Bits: 12; Voltage Supply Source: Single Supply; Supplier 1: Digi-Key; Supplier Part Number 1: MCP3201-CI/SN-ND; RoHS: RoHS Compliant; Power Dissipation (Max): -; Mounting Type: Surface Mount; Supplier: Digi-Key; Operating Temperature: -40°C ~ 85°C; Category: Integrated Circuits (ICs); Supplier Part Number: MCP3201-CI/SN-ND; Supplier Device Package: *; Packaging: Tube; Package / Case: 8-SOIC (3.9mm Width)
Y1 = XTAL: Crystal Oscillator; Published: 8-Jun-2000; LatestRevisionDate: 17-Jul-2002; LatestRevisionNote: Re-released for DXP Platform.; PackageReference: R38; Publisher: Altium Limited